# Altium schematic sheet [4]-MCU_POWER.SchDoc
size A4
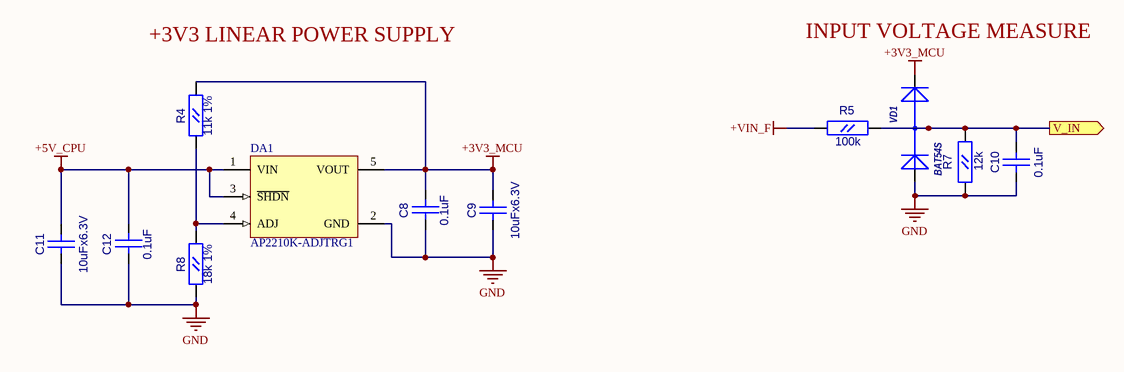
[diagram p0: [4]-MCU_POWER.SchDoc]

## Parts
C8  0.1uF  [CC0603]
C9  10uFx6.3V  [CC0805]
C10  0.1uF  [CC0603]
C11  10uFx6.3V  [CC0805]
C12  0.1uF  [CC0603]
DA1  AP2210K-ADJTRG1  [SOT23-5]
R4  11k 1%  [RC0603]
R5  100k  [RC0603]
R7  12k  [RC0603]
R8  18k 1%  [RC0603]
VD1  BAT54S  [SOT-23(GSD)]

## Ports
V_IN (out)

## Nets
+3V3_MCU: C8.1(A) C9.2(B) DA1.5(VOUT) R4.2(B) VD1.2(K)
+5V_CPU: C11.2(B) C12.1(A) DA1.1(VIN) DA1.3(~{SHDN})
+VIN_F: R5.1(A)
GND: C8.2(B) C9.1(A) C10.1(A) C11.1(A) C12.2(B) DA1.2(GND) R7.1(A) R8.1(A) VD1.1(A)
V_IN: C10.2(B) R5.2(B) R7.2(B) VD1.3(AK) ; port V_IN
NetDA1_4: DA1.4(ADJ) R4.1(A) R8.2(B)

## Notes on the sheet
- (near R4) +3V3 LINEAR POWER SUPPLY
- (near VD1) INPUT VOLTAGE MEASURE

## Library data of the parts
C8 C10 C12 = CC0603: Value: 0.1uF
C9 C11 = CC0805: Value: 10uFx6.3V
DA1 = MCP1824T-ADJE/OT: 300 mA, Low Voltage, Low Quiescent Current LDO Regulator, 5-Pin SOT-223, Extended Temperature, Tape and Reel; Published: 29-Jan-2009; DatasheetVersion: revA, Aug-2007; PackageVersion: revAW, Oct-2008; PackageReference: SOT-223-DC5; Publisher: Altium Limited; PackageDescription: 5-Lead Plastic Small Outline Transistor (DC) [SOT-223]; ComponentLink1Description: Manufacturer Link; ComponentLink1URL: http://www.microchip.com; ComponentLink2Description: Datasheet; ComponentLink2URL: http://ww1.microchip.com/downloads/en/DeviceDoc/22070a.pdf; ComponentLink3Description: Packaging Specification; ComponentLink3URL: http://ww1.microchip.com/downloads/en/PackagingSpec/00049AW.pdf
R4 R5 R7 R8 = RC0603
  R4: Value: 11k 1%
  R5: Value: 100k
  R7: Value: 12k
  R8: Value: 18k 1%
VD1 = BAT54S: 1.0 Ampere General Purpose Rectifier; ComponentField6: Published 8-Jun-2000, Modified 11-July-2000: SIM Model Added.; Value: *